# Altium schematic sheet Protect.SchDoc
size A; SheetNumber: 4; SheetTotal: 4
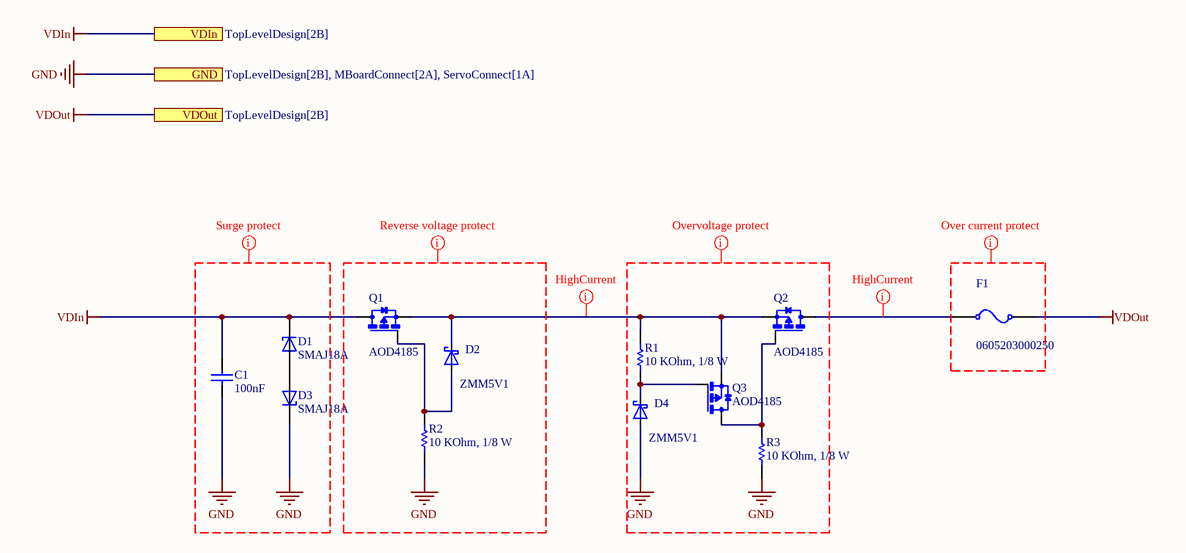
[diagram p0: Protect.SchDoc]

## Parts
C1  value 100nF  [CAP_0805]  (hidden comment: 0108051041050)
D1  SMAJ18A  [DIOM4325X250N]
D2  ZMM5V1  [SOD-80_MiniMELF_Glass]
D3  SMAJ18A  [DIOM4325X250N]
D4  ZMM5V1  [SOD-80_MiniMELF_Glass]
F1  0605203000250  [Fuse_Clip_0520]
Q1  AOD4185  [DPAK]
Q2  AOD4185  [DPAK]
Q3  AOD4185  [DPAK]
R1  value 10 KOhm, 1/8 W  [RESISTOR_0805]  (hidden comment: 0008051031)
R2  value 10 KOhm, 1/8 W  [RESISTOR_0805]  (hidden comment: 0008051031)
R3  value 10 KOhm, 1/8 W  [RESISTOR_0805]  (hidden comment: 0008051031)

## Ports
GND (see TopLevelDesign[2B], MBoardConnect[2A], ServoConnect[1A]), VDIn (see TopLevelDesign[2B]), VDOut (see TopLevelDesign[2B])

## Nets
GND: C1.1 D3.C D4.A R2.1 R3.1 ; port GND
VDIn: C1.2 D1.C Q1.4(D) ; port VDIn
VDOut: F1.1 ; port VDOut
NetD1_A: D1.A D3.A
NetD2_A: D2.A Q1.1(G) R2.2
NetD2_K: D2.K Q1.3(S) Q2.3(S) Q3.3(S) R1.2
NetD4_K: D4.K Q3.1(G) R1.1
NetF1_0: F1.0 Q2.4(D)
NetQ2_1: Q2.1(G) Q3.4(D) R3.2

## Layout directives
rule Width Constraint [Pref Width = 35mil    Min Width = 30mil    Max Width = 500mil]: GND
rule Width Constraint [Pref Width = 35mil    Min Width = 30mil    Max Width = 200mil]: (no net found under the mark), GND
rule Width Constraint [Pref Width = 50mil    Min Width = 50mil    Max Width = 100mil]: NetD2_K, NetF1_0

## Library data of the parts
C1 = CMP-001-00259-1: CAP, size 0805, 0.1 nF, 50 VDC; Manufacture Name: TDK; Manufacture SN: CGA4J2X8R1H104K125AD; Voltage Rating DC: 50 VDC; Tolerance: 10%; Pins: 2; Supplier 2 URL: https://www.digikey.com/en/products/detail/tdk-corporation/cga4j2x8r1h104k125ad/3248169; Supplier 1 SN: 810-C2012X8R1H104KEP; Supplier 1 Name: Mouser; Supplier 3 Name: thegioiic; Mounting Technology: SMT; Source: Capacitor_0805_10_percent.SchLib; Supplier 2 SN: 445-8810-2-ND; Supplier 3 SN: OEM; Operating Temperature: -55 to +125degC; Supplier 2 Name: Digi-Key; Component Type: Standard; Design Item ID: 0108051041050; Supplier 1 URL: https://www.mouser.vn/ProductDetail/TDK/CGA4J2X8R1H104K125AD?qs=LcTL%2F5vFEzExqZqv3rh1qQ%3D%3D&utm_source=mouser-refine-download&utm_medium=file&utm_campaign=CGA4J2X8R1H104K125AD&utm_content=TDK; Supplier 3 URL: N/A; Packaging: Tape and Reel; Size: 0805
D1 D3 = CMP-004-00085-1: 400W, 21.1V, 5%, Unidirectional, TVS; MF: Taiwan Semiconductor; SnapEDA_Link: https://www.snapeda.com/parts/SMAJ18A/taiwan/view-part/?ref=snap; Value: *; Component Type: Standard; Case/Package: SMA-2 Taiwan Semiconductor; Check_prices: https://www.snapeda.com/parts/SMAJ18A/taiwan/view-part/?ref=eda; Source: SMAJ18A.SchLib; Design Item ID: SMAJ18A; Pins: 2; MP: SMAJ18A
D2 D4 = CMP-004-00086-2: Value: Shottky-Diode; Reference: D; ki_keywords: Schottky; ki_description: Schottky Diode; Component Type: Standard; Pins: 2; Source: schottky-diode.SchLib; Design Item ID: Schottky-Diode; Datasheet: https://diotec.com/de/produktliste/SBD.html
F1 = CMP-005-00030-1: Ceramic Fuse, Size 0520, 250 VAC, 30A; Manufacturer: Littelfuse; Value: 250 VAC, 10A; Hold Current: 10A; Threshold Voltage: 250VAC; Threshold Current: 1.5kA (250VAC); ComponentLink4URL: https://www.thegioiic.com/cau-chi-su-10a-5x20mm; Component Type: Standard; ComponentLink2Description: Supplier 1 URL; Supplier 2 URL: https://www.digikey.com/en/products/detail/littelfuse-inc/0215010-MXP/777449; Supplier 1 Name: Mouser; ComponentLink1Description: Datasheet link; Supplier 2 Name: Digi-Key; ComponentLink3Description: Supplier 2 URL; Supplier 3 URL: https://www.thegioiic.com/cau-chi-su-10a-5x20mm; Supplier 2 SN: F1699-ND; Design Item ID: 0605201000250; Supplier 1 URL: https://www.mouser.vn/ProductDetail/Littelfuse/0215010.MXP?qs=qI%252BDxnNls1%252BmXG81o%252BQ0mA%3D%3D; ComponentLink4Description: Supplier 3 URL; Supplier 3 SN: N/A; Size: 0520; Source: Fuse_Clip.SchLib; ComponentLink2URL: https://www.mouser.vn/ProductDetail/Littelfuse/0215010.MXP?qs=qI%252BDxnNls1%252BmXG81o%252BQ0mA%3D%3D; Pins: 2; ComponentLink3URL: https://www.digikey.com/en/products/detail/littelfuse-inc/0215010-MXP/777449; ComponentLink1URL: https://www.littelfuse.com/~/media/electronics/datasheets/fuses/littelfuse_fuse_234_datasheet.pdf.pdf; Supplier 3 Name: thegioiic; Mounting Technology: Holder / Clip; Supplier 1 SN: 576-0215010.MXP
Q1-Q3 = CMP-123-000001-2: P-Channel 40V 40A (Tc) 2.5W (Ta), 62.5W (Tc) Surface Mount TO-252, (D-Pak); MF: Alpha &; Check_prices: https://www.snapeda.com/parts/AOD4185/Alpha/view-part/?ref=eda; MP: AOD4185; Package: TO-252 Alpha &amp; Omega Semiconductor; SnapEDA_Link: https://www.snapeda.com/parts/AOD4185/Alpha/view-part/?ref=snap; Design Item ID: AOD4185; Source: AOD4185.SchLib; Pin Count: 3; Value: *; Component Type: Standard
R1-R3 = CMP-009-00482-1: RES, size 0805, 10 KOhm, 1/8 W; Manufacture  Name: Vishay Dale; Manufacture  SN: CRCW080515K0FKEAC; Rated Power: 1/8 W; Resistance Tolerance: +/-1%; ComponentLink3URL: https://www.digikey.com/en/products/detail/vishay-dale/CRCW080515K0FKEAC/7928558; Supplier 3 SN: N/A; ComponentLink1URL: https://www.vishay.com/docs/28773/crcwce3.pdf; ComponentLink2Description: Supplier 1 URL; Mounting Technology: SMT; Supplier 1 SN: 71-CRCW0805-15K-E3; ComponentLink3Description: Supplier 2 URL; Pins: 2; Size: 0805; ComponentLink1Description: Datasheet link; Supplier 3 URL: N/A; Source: Resistor_0805.SchLib; Supplier 2 URL: https://www.digikey.com/en/products/detail/vishay-dale/CRCW080515K0FKEAC/7928558; ComponentLink4URL: N/A; Supplier 1 URL: https://www.mouser.vn/ProductDetail/Vishay-Dale/CRCW080515K0FKEA?qs=bMjB6bAaLEM4rXT2DoR3BA%3D%3D; Supplier 1 Name: Mouser; Design Item ID: 0008051531; Supplier 2 SN: 541-4136-2-ND; Component Type: Standard; ComponentLink2URL: https://www.mouser.vn/ProductDetail/Vishay-Dale/CRCW080515K0FKEA?qs=bMjB6bAaLEM4rXT2DoR3BA%3D%3D; Supplier 2 Name: Digi-Key; ComponentLink4Description: Supplier 3 URL; Supplier 3 Name: Thegioiic